# EAGLE schematic schematic (EAGLE 6.3)
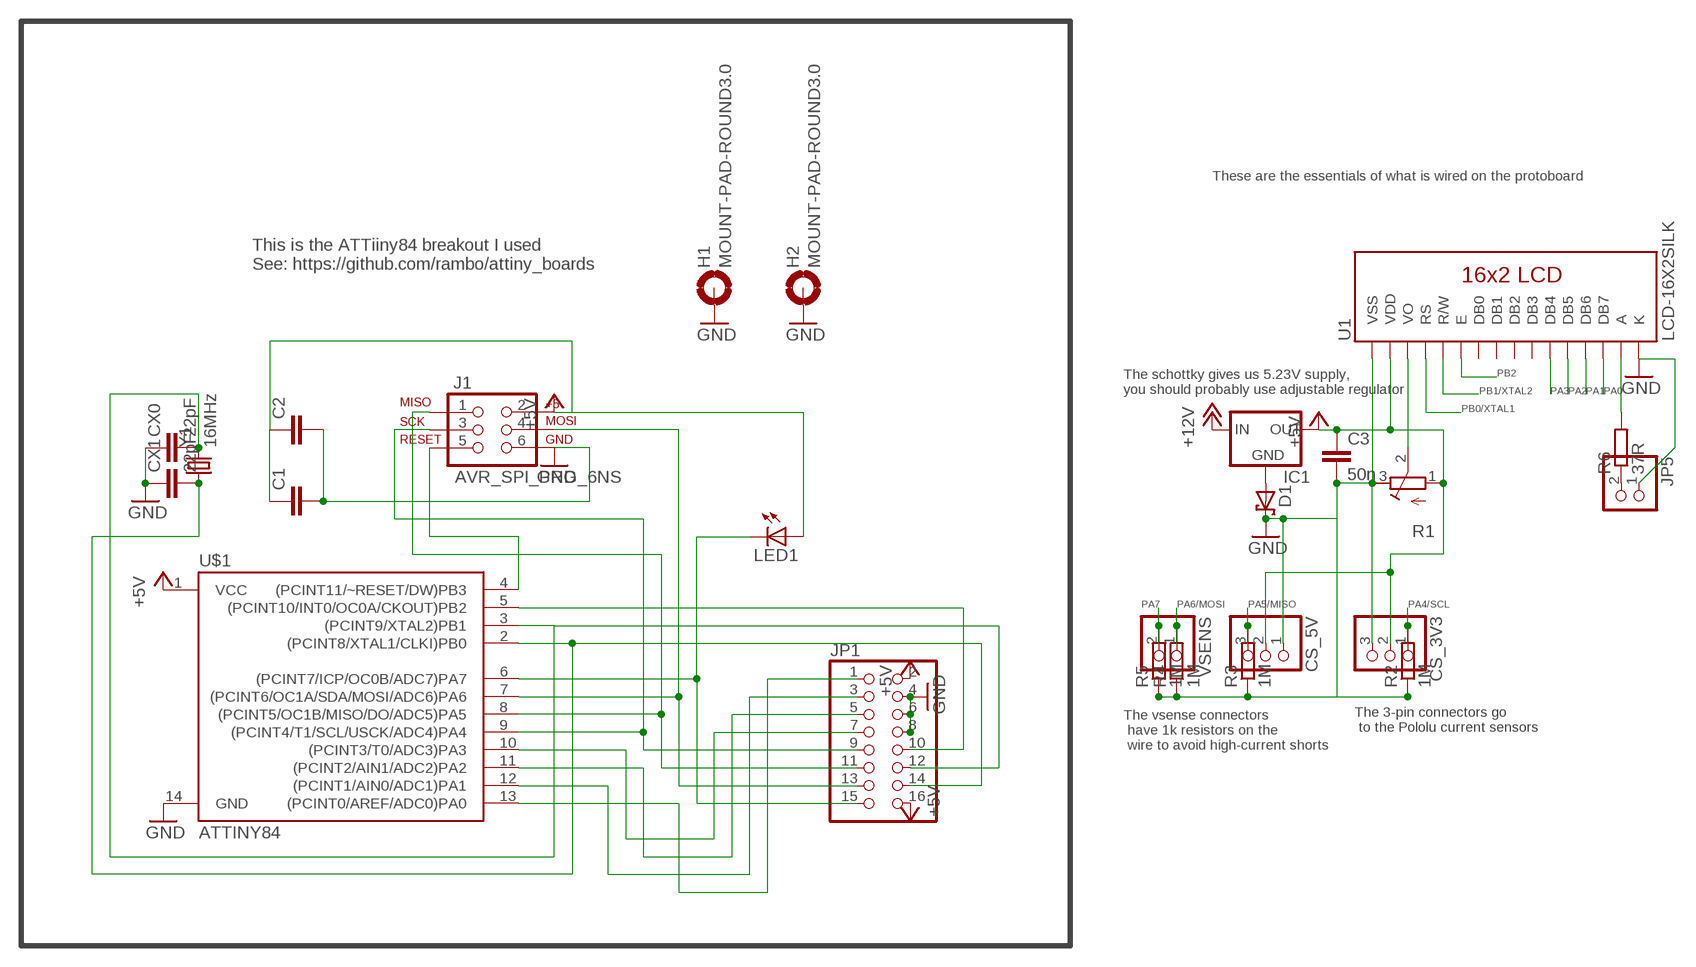
[diagram p0: schematic, sheet 1]

## Parts
C1  C-EUC0805  [C0805]
C2  C-EUC0805  [C0805]
C3  50n  C-EU025-025X050  [C025-025X050]
CS_3V3  PINHD-1X3  [1X03]
CS_5V  PINHD-1X3  [1X03]
CX0  22pF  C-EUC0603  [C0603]
CX1  22pF  C-EUC0603  [C0603]
D1  SCHOTTKY-DIODEC4111-15  [C4111-15]
H1  MOUNT-PAD-ROUND3.0  [3,0-PAD]
H2  MOUNT-PAD-ROUND3.0  [3,0-PAD]
IC1  V_REG_78XX-TO-220  [TO-220-ALT]
J1  AVR_SPI_PRG_6NS  [2X3-NS]
JP1  PINHD-2X8  [2X08]
JP5  PINHD-1X2  [1X02]
LED1  LED0603  [LED-0603]
R1  R-TRIMM64W  [RTRIM64W]
R2  1M  R-EU_0204/7  [0204/7]
R3  1M  R-EU_0204/7  [0204/7]
R4  1M  R-EU_0204/7  [0204/7]
R5  1M  R-EU_0204/7  [0204/7]
R6  37R  R-EU_0204/7  [0204/7]
U1  LCD-16X2SILK  [LCD-16X2]
U$1  ATTINY84  [SO14]
VSENS  PINHD-1X2  [1X02]
Y1  16MHz  CRYSTAL5X3  [CRYSTAL-SMD-5X3]

## Nets
+5V [POWER]: C1.1 C2.1 C3.1 CS_3V3.2 CS_5V.2 IC1.OUT J1.2 JP1.2 JP1.16 LED1.A R1.1(A) U1.2(VDD) U$1.1(VCC)
+12V: IC1.IN
GND [POWER]: C1.2 C2.2 C3.2 CS_3V3.3 CS_5V.1 CX0.1 CX1.1 D1.C H1.B3,0(MOUNT) H2.B3,0(MOUNT) J1.6 JP1.4 JP1.6 JP1.8 JP5.1 R1.3(E) R2.1 R3.1 R4.1 R5.1 U1.1(VSS) U1.16(K) U$1.14(GND)
LCD_VO: R1.2(S) U1.3(VO)
N$1: JP5.2 R6.1
N$2: D1.A IC1.GND
N$3: R6.2 U1.15(A)
PA0: JP1.1 U1.14(DB7) U$1.13((PCINT0/AREF/ADC0)PA0)
PA1: JP1.3 U1.13(DB6) U$1.12((PCINT1/AIN0/ADC1)PA1)
PA2: JP1.5 U1.12(DB5) U$1.11((PCINT2/AIN1/ADC2)PA2)
PA3: JP1.7 U1.11(DB4) U$1.10((PCINT3/T0/ADC3)PA3)
PA4/SCL: CS_3V3.1 J1.3 JP1.9 R2.2 U$1.9((PCINT4/T1/SCL/USCK/ADC4)PA4)
PA5/MISO: CS_5V.3 J1.1 JP1.11 R3.2 U$1.8((PCINT5/OC1B/MISO/DO/ADC5)PA5)
PA6/MOSI: J1.4 JP1.13 R4.2 U$1.7((PCINT6/OC1A/SDA/MOSI/ADC6)PA6) VSENS.1
PA7: JP1.15 LED1.C R5.2 U$1.6((PCINT7/ICP/OC0B/ADC7)PA7) VSENS.2
PB0/XTAL1: CX1.2 JP1.14 U1.4(RS) U$1.2((PCINT8/XTAL1/CLKI)PB0) Y1.1
PB1/XTAL2: CX0.2 JP1.12 U1.5(R/W) U$1.3((PCINT9/XTAL2)PB1) Y1.3
PB2: JP1.10 U1.6(E) U$1.5((PCINT10/INT0/OC0A/CKOUT)PB2)
PB3/RESET-: J1.5 U$1.4((PCINT11/~RESET/DW)PB3)
Unconnected: U1.7(DB0) U1.8(DB1) U1.9(DB2) U1.10(DB3)

## Notes on the sheet
- These are the essentials of what is wired on the protoboard
- This is the ATTiiny84 breakout I used
  See: https://github.com/rambo/attiny_boards
- The schottky gives us 5.23V supply, 
  you should probably use adjustable regulator
- The 3-pin connectors go
   to the Pololu current sensors
- The vsense connectors
   have 1k resistors on the
   wire to avoid high-current shorts

## Library data of the parts
C1-C3 CX0 CX1 = rcl:C-EU: CAPACITOR, European symbol
CS_3V3 CS_5V = pinhead:PINHD-1X3: PIN HEADER
D1 = diode:SCHOTTKY-DIODE: Schottky Diode
H1 H2 = holes:MOUNT-PAD-ROUND: MOUNTING PAD, round
IC1 = SparkFun-PowerIC:V_REG_78XX: Voltage Regulator Standard 7805 5V regulator. IGO (Input Ground Output). Spark Fun Electronics SKU : COM-00107
J1 = SparkFun-Connectors:AVR_SPI_PRG_6: AVR ISP 6 Pin This is the reduced ISP connector for AVR programming. Common on Arduino. This footprint will take up less PCB space and can be used with a 10-pin to 6-pin adapter such as SKU: BOB-08508
JP1 = pinhead:PINHD-2X8: PIN HEADER
JP5 VSENS = pinhead:PINHD-1X2: PIN HEADER
LED1 = SparkFun-LED:LED: LEDs Standard schematic elements and footprints for 5mm, 3mm, 1206, and 0603 sized LEDs. 5mm - Spark Fun Electronics SKU : COM-00529 (and others)
R1 = rcl:R-TRIMM: Trimm resistor
R2-R6 = resistor:R-EU_: RESISTOR, European symbol
U1 = SparkFun-Displays:LCD-16X2: Standard text-only 16x2 parallel input LCD
U$1 = SparkFun-DigitalIC:ATTINY84: Atmel 14-pin 2/4/8kB flash uC
Y1 = SparkFun-FreqCtrl:CRYSTAL: Various standard crystals. Proven footprints. Spark Fun Electronics SKU : COM-00534

## Net classes
1 POWER: width 0.254 mm